# EasyEDA schematic Manas_JLCPCB_2020-11-11_10-35-08.json
TITLE: JLCPCB Contest; REV: 1.0; Date: 2020-11-07; Sheet: 1/1; Drawn By: Manas Pange; Company: Your Company
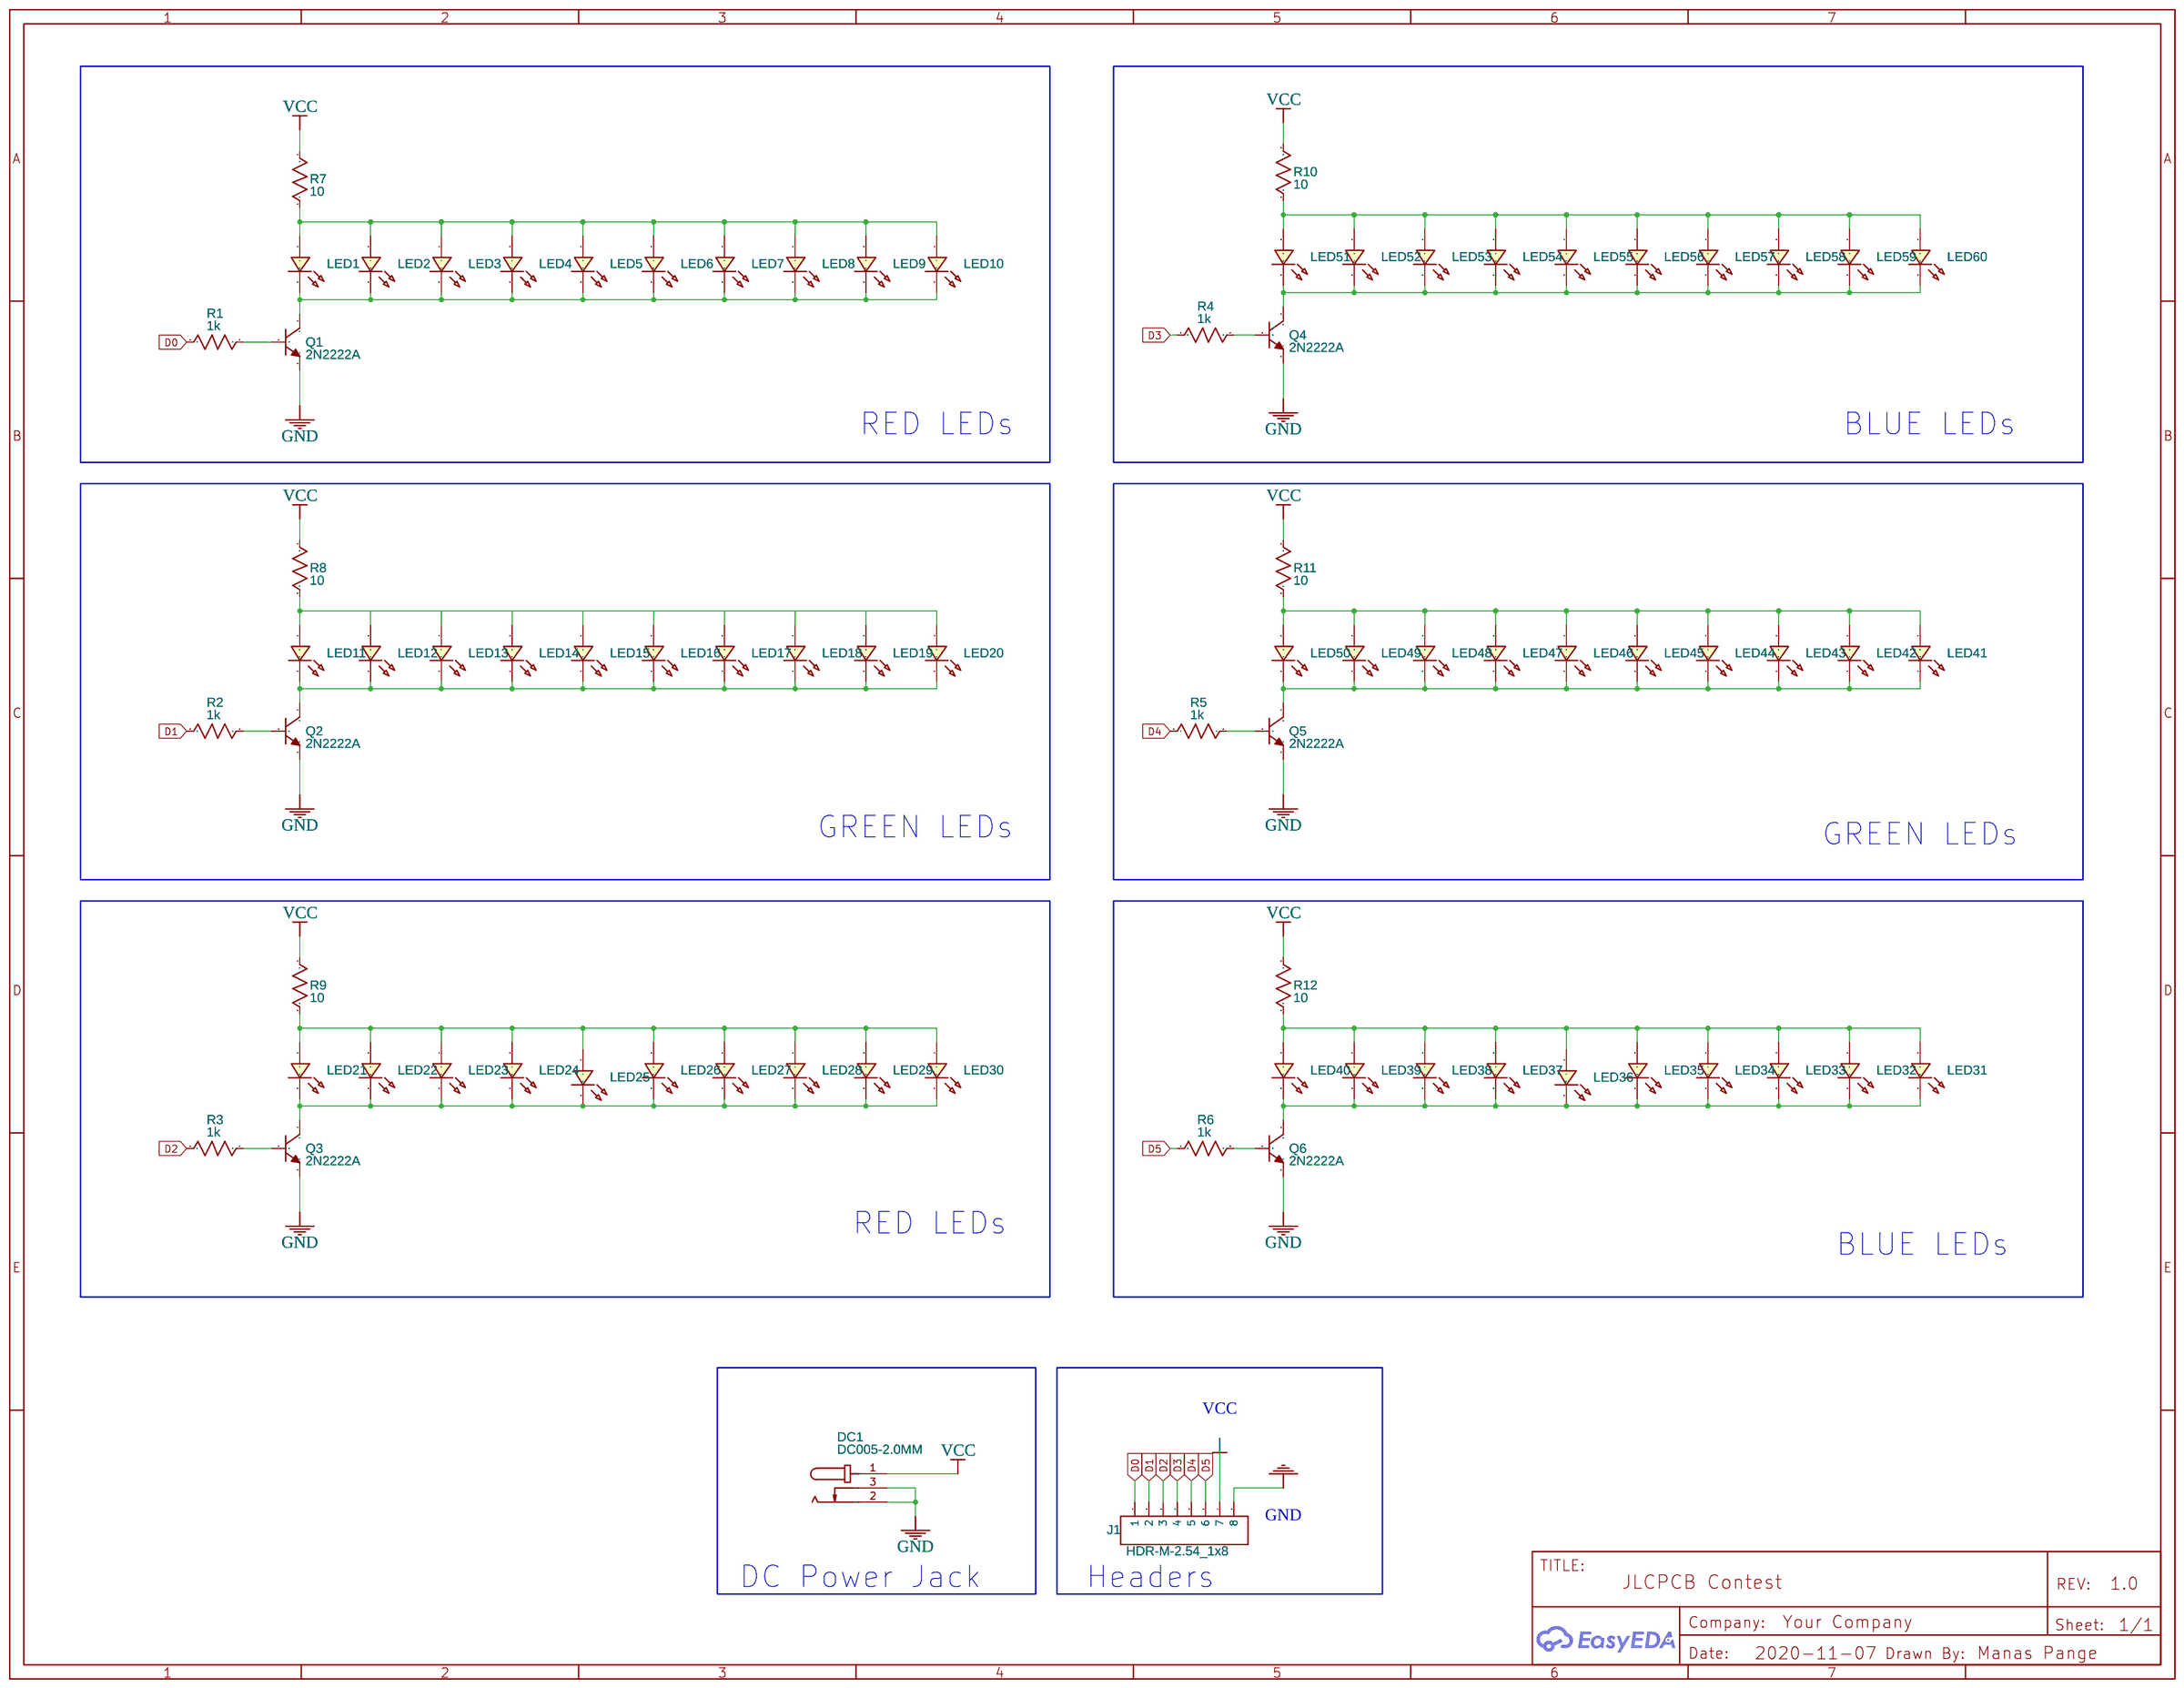
[diagram p0: schematic sheet]

## Parts
DC1  DC005-2.0MM  [DC-IN-TH_DC005]
J1  HDR-M-2.54_1x8  [HDR-M-2.54_1X8]
LED1  LED-TH-3mm_R  [LED-TH_BD3.0_RED]
LED2  LED-TH-3mm_R  [LED-TH_BD3.0_RED]
LED3  LED-TH-3mm_R  [LED-TH_BD3.0_RED]
LED4  LED-TH-3mm_R  [LED-TH_BD3.0_RED]
LED5  LED-TH-3mm_R  [LED-TH_BD3.0_RED]
LED6  LED-TH-3mm_R  [LED-TH_BD3.0_RED]
LED7  LED-TH-3mm_R  [LED-TH_BD3.0_RED]
LED8  LED-TH-3mm_R  [LED-TH_BD3.0_RED]
LED9  LED-TH-3mm_R  [LED-TH_BD3.0_RED]
LED10  LED-TH-3mm_R  [LED-TH_BD3.0_RED]
LED11  LED-TH-3mm_G  [LED-TH_BD3.0_GREEN]
LED12  LED-TH-3mm_G  [LED-TH_BD3.0_GREEN]
LED13  LED-TH-3mm_G  [LED-TH_BD3.0_GREEN]
LED14  LED-TH-3mm_G  [LED-TH_BD3.0_GREEN]
LED15  LED-TH-3mm_G  [LED-TH_BD3.0_GREEN]
LED16  LED-TH-3mm_G  [LED-TH_BD3.0_GREEN]
LED17  LED-TH-3mm_G  [LED-TH_BD3.0_GREEN]
LED18  LED-TH-3mm_G  [LED-TH_BD3.0_GREEN]
LED19  LED-TH-3mm_G  [LED-TH_BD3.0_GREEN]
LED20  LED-TH-3mm_G  [LED-TH_BD3.0_GREEN]
LED21  LED-TH-3mm_R  [LED-TH_BD3.0_RED]
LED22  LED-TH-3mm_R  [LED-TH_BD3.0_RED]
LED23  LED-TH-3mm_R  [LED-TH_BD3.0_RED]
LED24  LED-TH-3mm_R  [LED-TH_BD3.0_RED]
LED25  LED-TH-3mm_R  [LED-TH_BD3.0_RED]
LED26  LED-TH-3mm_R  [LED-TH_BD3.0_RED]
LED27  LED-TH-3mm_R  [LED-TH_BD3.0_RED]
LED28  LED-TH-3mm_R  [LED-TH_BD3.0_RED]
LED29  LED-TH-3mm_R  [LED-TH_BD3.0_RED]
LED30  LED-TH-3mm_R  [LED-TH_BD3.0_RED]
LED31  LED-TH-3mm_B  [LED-TH_BD3.0_BLUE]
LED32  LED-TH-3mm_B  [LED-TH_BD3.0_BLUE]
LED33  LED-TH-3mm_B  [LED-TH_BD3.0_BLUE]
LED34  LED-TH-3mm_B  [LED-TH_BD3.0_BLUE]
LED35  LED-TH-3mm_B  [LED-TH_BD3.0_BLUE]
LED36  LED-TH-3mm_B  [LED-TH_BD3.0_BLUE]
LED37  LED-TH-3mm_B  [LED-TH_BD3.0_BLUE]
LED38  LED-TH-3mm_B  [LED-TH_BD3.0_BLUE]
LED39  LED-TH-3mm_B  [LED-TH_BD3.0_BLUE]
LED40  LED-TH-3mm_B  [LED-TH_BD3.0_BLUE]
LED41  LED-TH-3mm_G  [LED-TH_BD3.0_GREEN]
LED42  LED-TH-3mm_G  [LED-TH_BD3.0_GREEN]
LED43  LED-TH-3mm_G  [LED-TH_BD3.0_GREEN]
LED44  LED-TH-3mm_G  [LED-TH_BD3.0_GREEN]
LED45  LED-TH-3mm_G  [LED-TH_BD3.0_GREEN]
LED46  LED-TH-3mm_G  [LED-TH_BD3.0_GREEN]
LED47  LED-TH-3mm_G  [LED-TH_BD3.0_GREEN]
LED48  LED-TH-3mm_G  [LED-TH_BD3.0_GREEN]
LED49  LED-TH-3mm_G  [LED-TH_BD3.0_GREEN]
LED50  LED-TH-3mm_G  [LED-TH_BD3.0_GREEN]
LED51  LED-TH-3mm_B  [LED-TH_BD3.0_BLUE]
LED52  LED-TH-3mm_B  [LED-TH_BD3.0_BLUE]
LED53  LED-TH-3mm_B  [LED-TH_BD3.0_BLUE]
LED54  LED-TH-3mm_B  [LED-TH_BD3.0_BLUE]
LED55  LED-TH-3mm_B  [LED-TH_BD3.0_BLUE]
LED56  LED-TH-3mm_B  [LED-TH_BD3.0_BLUE]
LED57  LED-TH-3mm_B  [LED-TH_BD3.0_BLUE]
LED58  LED-TH-3mm_B  [LED-TH_BD3.0_BLUE]
LED59  LED-TH-3mm_B  [LED-TH_BD3.0_BLUE]
LED60  LED-TH-3mm_B  [LED-TH_BD3.0_BLUE]
Q1  2N2222A  [TO-92-3_L4.8-W3.7-P2.54-R]
Q2  2N2222A  [TO-92-3_L4.8-W3.7-P2.54-R]
Q3  2N2222A  [TO-92-3_L4.8-W3.7-P2.54-R]
Q4  2N2222A  [TO-92-3_L4.8-W3.7-P2.54-R]
Q5  2N2222A  [TO-92-3_L4.8-W3.7-P2.54-R]
Q6  2N2222A  [TO-92-3_L4.8-W3.7-P2.54-R]
R1  1k  [R_AXIAL-0.3]
R2  1k  [R_AXIAL-0.3]
R3  1k  [R_AXIAL-0.3]
R4  1k  [R_AXIAL-0.3]
R5  1k  [R_AXIAL-0.3]
R6  1k  [R_AXIAL-0.3]
R7  10  [R_AXIAL-0.5]
R8  10  [R_AXIAL-0.5]
R9  10  [R_AXIAL-0.5]
R10  10  [R_AXIAL-0.5]
R11  10  [R_AXIAL-0.5]
R12  10  [R_AXIAL-0.5]

## Library data of the parts
DC1 = DC005-2.0MM: Supplier: LCSC; Manufacturer: SOFNG; Supplier Part: C111567
J1 = HDR-M-2.54_1x8: Supplier Part: C190820; Supplier: LCSC; Contributor: LCEDA_Lib
LED1-LED10 LED21-LED30 = LED-TH-3mm_R: Manufacturer: EVERLIGHT(台湾亿光); Manufacturer Part: 204-10SDRD/S530-A3-L; Supplier Part: C84774; Supplier: LCSC; Contributor: LCEDA_Lib
LED11-LED20 LED41-LED50 = LED-TH-3mm_G: Manufacturer: EVERLIGHT(台湾亿光); Manufacturer Part: 204-10SYGD/S530-E3; Supplier Part: C85161; Contributor: LCEDA_Lib
LED31-LED40 LED51-LED60 = LED-TH-3mm_B: Manufacturer: EVERLIGHT(台湾亿光); Manufacturer Part: 204-10SUBC/S400-A4; Supplier Part: C86881; Supplier: LCSC; Contributor: LCEDA_Lib
Q1-Q6 = 2N2222A: Supplier: LCSC; Supplier Part: C358533; Manufacturer: Foshan Blue Rocket Elec; Contributor: LCSC
R1-R6 = R_AXIAL-0.3_US: Contributor: LCEDA_Lib
R7-R12 = R_AXIAL-0.5_US: Contributor: LCEDA_Lib

## Nets
GND: DC1.2 DC1.3 Q1.3(E) Q2.3(E) Q3.3(E) Q4.3(E) Q5.3(E) Q6.3(E)
VCC: DC1.1 J1.7 R7.1 R8.1 R9.1 R10.1 R11.1 R12.1
D0: R1.1
D1: R2.1
D2: R3.1
D3: R4.2
D4: R5.1
D5: R6.1
Net-(LED1-1): LED1.1 LED2.1 LED3.1 LED4.1 LED5.1 LED6.1 LED7.1 LED8.1 LED9.1 LED10.1 R7.2
Net-(LED1-2): LED1.2 LED2.2 LED3.2 LED4.2 LED5.2 LED6.2 LED7.2 LED8.2 LED9.2 LED10.2 Q1.1(C)
Net-(LED11-1): LED11.1 LED20.1 R8.2
Net-(LED11-2): LED11.2 LED12.2 LED13.2 LED14.2 LED15.2 LED16.2 LED17.2 LED18.2 LED19.2 LED20.2 Q2.1(C)
Net-(LED21-1): LED21.1 LED22.1 LED23.1 LED24.1 LED25.1 LED26.1 LED27.1 LED28.1 LED29.1 LED30.1 R9.2
Net-(LED21-2): LED21.2 LED22.2 LED23.2 LED24.2 LED25.2 LED26.2 LED27.2 LED28.2 LED29.2 LED30.2 Q3.1(C)
Net-(LED31-1): LED31.1 LED32.1 LED33.1 LED34.1 LED35.1 LED36.1 LED37.1 LED38.1 LED39.1 LED40.1 R12.2
Net-(LED31-2): LED31.2 LED32.2 LED33.2 LED34.2 LED35.2 LED36.2 LED37.2 LED38.2 LED39.2 LED40.2 Q6.1(C)
Net-(LED41-1): LED41.1 LED42.1 LED43.1 LED44.1 LED45.1 LED46.1 LED47.1 LED48.1 LED49.1 LED50.1 R11.2
Net-(LED41-2): LED41.2 LED42.2 LED43.2 LED44.2 LED45.2 LED46.2 LED47.2 LED48.2 LED49.2 LED50.2 Q5.1(C)
Net-(LED51-1): LED51.1 LED52.1 LED53.1 LED54.1 LED55.1 LED56.1 LED57.1 LED58.1 LED59.1 LED60.1 R10.2
Net-(LED51-2): LED51.2 LED52.2 LED53.2 LED54.2 LED55.2 LED56.2 LED57.2 LED58.2 LED59.2 LED60.2 Q4.1(C)
Net-(Q1-2): Q1.2(B) R1.2
Net-(Q2-2): Q2.2(B) R2.2
Net-(Q3-2): Q3.2(B) R3.2
Net-(Q4-2): Q4.2(B) R4.1
Net-(Q5-2): Q5.2(B) R5.2
Net-(Q6-2): Q6.2(B) R6.2

Not connected (* = marked no-connect by the designer): J1 1 2 3 4 5 6 8; LED12 1; LED13 1; LED14 1; LED15 1; LED16 1; LED17 1; LED18 1; LED19 1

## Notes on the sheet
- RED LEDs
- BLUE LEDs
- GREEN LEDs
- GREEN LEDs
- RED LEDs
- BLUE LEDs
- DC Power Jack
- Headers
